# Altium project ESP32_INDUSTRIAL_IO_EXPANSION.PrjPcb
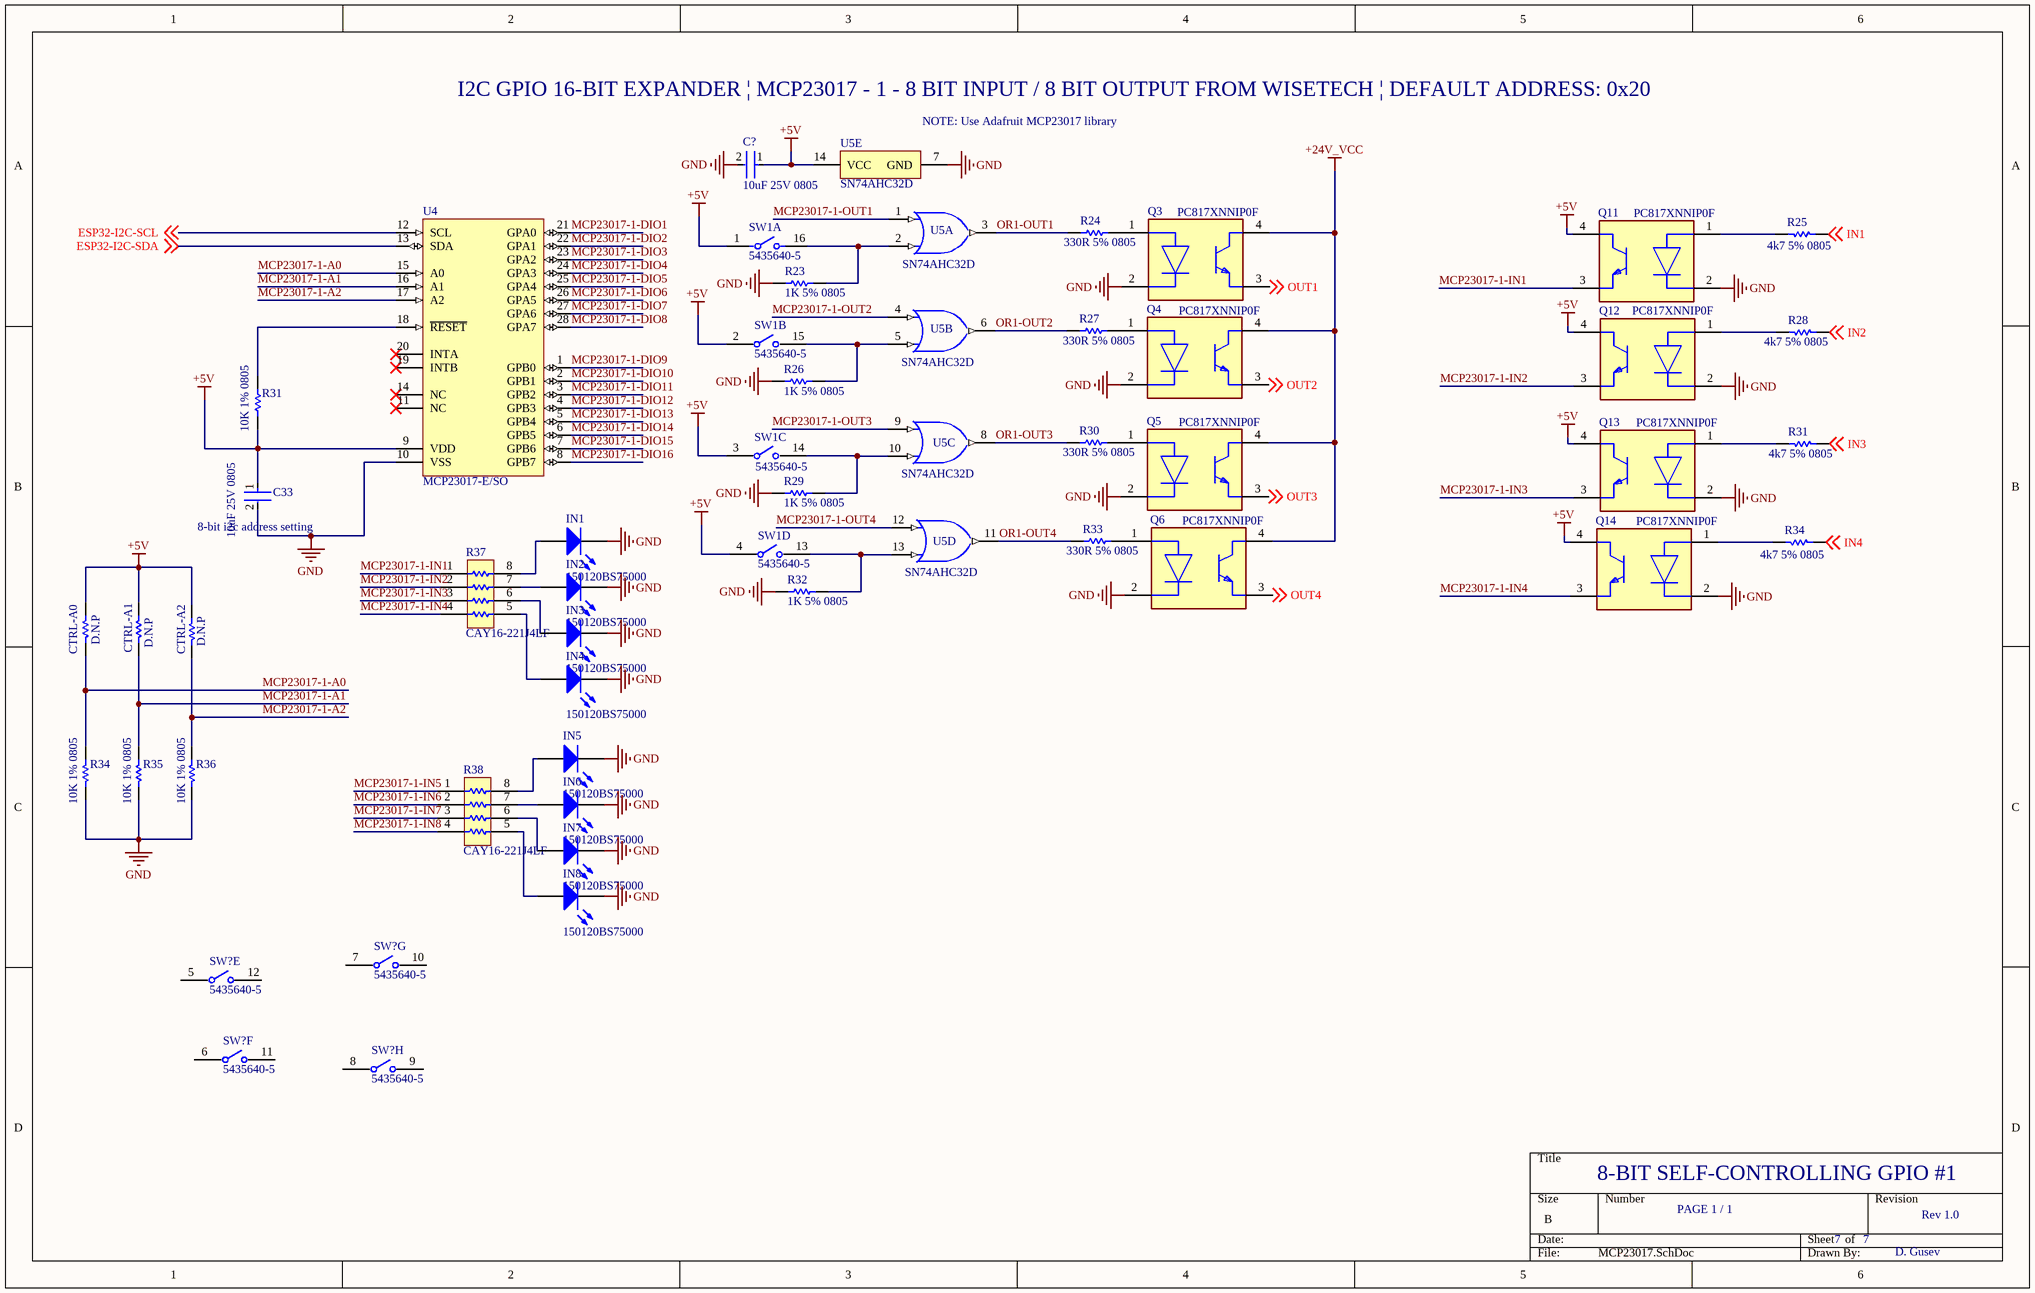
[diagram p0: MCP23017.SchDoc]
2 sheets, 63 parts. Net scope: global (net labels, ports and power ports of the same name join across sheets).
Sheets:
  MCP23017.SchDoc
  CONN.SchDoc

## Sheet MCP23017.SchDoc
size B

### Parts
(Parts that share a designator on the sheet are numbered #1, #2 ... from top to bottom, then left to right.)
C33  10uF 25V 0805  [FP-GRM21B-0_15-IPC_B]
C?  10uF 25V 0805  [FP-GRM21B-0_15-IPC_B]
CTRL-A0  D.N.P  [RESC2013X60X35LL10T20]
CTRL-A1  D.N.P  [RESC2013X60X35LL10T20]
CTRL-A2  D.N.P  [RESC2013X60X35LL10T20]
IN1  150120BS75000  [1206_A]
IN2  150120BS75000  [1206_A]
IN3  150120BS75000  [1206_A]
IN4  150120BS75000  [1206_A]
IN5  150120BS75000  [1206_A]
IN6  150120BS75000  [1206_A]
IN7  150120BS75000  [1206_A]
IN8  150120BS75000  [1206_A]
Q3  PC817XNNIP0F  [FP-PC817XNNIP0F-MFG]
Q4  PC817XNNIP0F  [FP-PC817XNNIP0F-MFG]
Q5  PC817XNNIP0F  [FP-PC817XNNIP0F-MFG]
Q6  PC817XNNIP0F  [FP-PC817XNNIP0F-MFG]
Q11  PC817XNNIP0F  [FP-PC817XNNIP0F-MFG]
Q12  PC817XNNIP0F  [FP-PC817XNNIP0F-MFG]
Q13  PC817XNNIP0F  [FP-PC817XNNIP0F-MFG]
Q14  PC817XNNIP0F  [FP-PC817XNNIP0F-MFG]
R23  1K 5% 0805  [RESC2013X60X35ML10T20]
R24  330R 5% 0805  [RESC2013X60X35LL10T20]
R25  4k7 5% 0805  [YAGO-RC0805_M]
R26  1K 5% 0805  [RESC2013X60X35ML10T20]
R27  330R 5% 0805  [RESC2013X60X35LL10T20]
R28  4k7 5% 0805  [YAGO-RC0805_M]
R29  1K 5% 0805  [RESC2013X60X35ML10T20]
R30  330R 5% 0805  [RESC2013X60X35LL10T20]
R31#1  10K 1% 0805  [RESC2013X60X35ML10T20]
R31#2  4k7 5% 0805  [YAGO-RC0805_M]
R32  1K 5% 0805  [RESC2013X60X35ML10T20]
R33  330R 5% 0805  [RESC2013X60X35LL10T20]
R34#1  4k7 5% 0805  [YAGO-RC0805_M]
R34#2  10K 1% 0805  [RESC2013X60X35ML10T20]
R35  10K 1% 0805  [RESC2013X60X35ML10T20]
R36  10K 1% 0805  [RESC2013X60X35ML10T20]
R37  CAY16-221J4LF  [BOUR-CAY16-J4_V]
R38  CAY16-221J4LF  [BOUR-CAY16-J4_V]
SW1  5435640-5  [FP-5435640-5-MFG]  (parts A,B,C,D of 8)
SW?#1  5435640-5  [FP-5435640-5-MFG]  (part G of 8)
SW?#2  5435640-5  [FP-5435640-5-MFG]  (part E of 8)
SW?#3  5435640-5  [FP-5435640-5-MFG]  (part F of 8)
SW?#4  5435640-5  [FP-5435640-5-MFG]  (part H of 8)
U4  MCP23017-E/SO  [SOIC-SO28_N]
U5  SN74AHC32D  [D0014A_M]  (parts A,B,C,D,E of 5)

### Nets
+5V: C33.1 C?.1 CTRL-A0.2 CTRL-A1.2 CTRL-A2.2 Q11.4(C) Q12.4(C) Q13.4(C) Q14.4(C) R31#1.1 SW1.1 SW1.2 SW1.3 SW1.4 U4.9(VDD) U5.14(VCC)
+24V_VCC: Q3.4(C) Q4.4(C) Q5.4(C) Q6.4(C)
GND: C33.2 C?.2 IN1.1(K) IN2.1(K) IN3.1(K) IN4.1(K) IN5.1(K) IN6.1(K) IN7.1(K) IN8.1(K) Q3.2(C) Q4.2(C) Q5.2(C) Q6.2(C) Q11.2(C) Q12.2(C) Q13.2(C) Q14.2(C) R23.1 R26.1 R29.1 R32.1 R34#2.2 R35.2 R36.2 U4.10(VSS) U5.7(GND)
ESP32-I2C-SCL: U4.12(SCL) ; off-sheet ESP32-I2C-SCL
ESP32-I2C-SDA: U4.13(SDA) ; off-sheet ESP32-I2C-SDA
IN1: R25.1 ; off-sheet IN1
IN2: R28.1 ; off-sheet IN2
IN3: R31#2.1 ; off-sheet IN3
IN4: R34#1.1 ; off-sheet IN4
MCP23017-1-A0: CTRL-A0.1 R34#2.1 U4.15(A0)
MCP23017-1-A1: CTRL-A1.1 R35.1 U4.16(A1)
MCP23017-1-A2: CTRL-A2.1 R36.1 U4.17(A2)
MCP23017-1-DIO1: U4.21(GPA0)
MCP23017-1-DIO2: U4.22(GPA1)
MCP23017-1-DIO3: U4.23(GPA2)
MCP23017-1-DIO4: U4.24(GPA3)
MCP23017-1-DIO5: U4.25(GPA4)
MCP23017-1-DIO6: U4.26(GPA5)
MCP23017-1-DIO7: U4.27(GPA6)
MCP23017-1-DIO8: U4.28(GPA7)
MCP23017-1-DIO9: U4.1(GPB0)
MCP23017-1-DIO10: U4.2(GPB1)
MCP23017-1-DIO11: U4.3(GPB2)
MCP23017-1-DIO12: U4.4(GPB3)
MCP23017-1-DIO13: U4.5(GPB4)
MCP23017-1-DIO14: U4.6(GPB5)
MCP23017-1-DIO15: U4.7(GPB6)
MCP23017-1-DIO16: U4.8(GPB7)
MCP23017-1-IN1: Q11.3(E) R37.1
MCP23017-1-IN2: Q12.3(E) R37.2
MCP23017-1-IN3: Q13.3(E) R37.3
MCP23017-1-IN4: Q14.3(E) R37.4
MCP23017-1-IN5: R38.1
MCP23017-1-IN6: R38.2
MCP23017-1-IN7: R38.3
MCP23017-1-IN8: R38.4
MCP23017-1-OUT1: U5.1(1A)
MCP23017-1-OUT2: U5.4(2A)
MCP23017-1-OUT3: U5.9(3A)
MCP23017-1-OUT4: U5.12(4A)
OR1-OUT1: R24.1 U5.3(1Y)
OR1-OUT2: R27.1 U5.6(2Y)
OR1-OUT3: R30.1 U5.8(3Y)
OR1-OUT4: R33.1 U5.11(4Y)
OUT1: Q3.3(E) ; off-sheet OUT1
OUT2: Q4.3(E) ; off-sheet OUT2
OUT3: Q5.3(E) ; off-sheet OUT3
OUT4: Q6.3(E) ; off-sheet OUT4
NetIN1_2: IN1.2(A) R37.8
NetIN2_2: IN2.2(A) R37.7
NetIN3_2: IN3.2(A) R37.6
NetIN4_2: IN4.2(A) R37.5
NetIN5_2: IN5.2(A) R38.8
NetIN6_2: IN6.2(A) R38.7
NetIN7_2: IN7.2(A) R38.6
NetIN8_2: IN8.2(A) R38.5
NetQ3_1: Q3.1(A) R24.2
NetQ4_1: Q4.1(A) R27.2
NetQ5_1: Q5.1(A) R30.2
NetQ6_1: Q6.1(A) R33.2
NetQ11_1: Q11.1(A) R25.2
NetQ12_1: Q12.1(A) R28.2
NetQ13_1: Q13.1(A) R31#2.2
NetQ14_1: Q14.1(A) R34#1.2
NetR23_2: R23.2 SW1.16 U5.2(1B)
NetR26_2: R26.2 SW1.15 U5.5(2B)
NetR29_2: R29.2 SW1.14 U5.10(3B)
NetR31#1_2: R31#1.2 U4.18(~{RESET})
NetR32_2: R32.2 SW1.13 U5.13(4B)

Not connected (* = marked no-connect by the designer): SW?#1 7 10; SW?#2 5 12; SW?#3 6 11; SW?#4 8 9; U4 11(NC)* 14(NC)* 19(INTB)* 20(INTA)*

### Notes on the sheet
- I2C GPIO 16-BIT EXPANDER | MCP23017 - 1 - 8 BIT INPUT / 8 BIT OUTPUT FROM WISETECH | DEFAULT ADDRESS: 0x20
- (near U5) NOTE: Use Adafruit MCP23017 library
- 8-bit i2c address setting
- 8-BIT SELF-CONTROLLING GPIO #1
- PAGE 1 / 1
- 7
- Rev 1.0
- D. Gusev

### Library data of the parts
C33 C? = CMP-2007-03541-2: Chip Multilayer Ceramic Capacitors for General Purpose, 0805, 10uF, X5R, 15%, 10%, 25V; Length: 2mm; Depth: 1.25mm; Termination: SMD/SMT; Voltage: 25V; Height: 1.25mm; Material: Ceramic; Thickness: 0.053inch; Radiation Hardening: No; Min Operating Temperature: -55°C; Width: 0.049inch; Package Quantity: 1; Mount: Surface Mount; Dielectric: X5R; Packaging: Tape and Reel; Capacitance: 10uF; Voltage Rating (DC): 25V; Lead Free: Lead Free; Max Operating Temperature: 85°C; Case Code (Imperial): 0805; Case/Package: 0805; Tolerance: 10%; Voltage Rating: 25V; Case Code (Metric): 2012
CTRL-A0-CTRL-A2 = CMP-1659-00014-4: Chip Resistor, 1 Ohm, +/- 1%, 125 mW, -55 to 155 degC, 0805 (2012 Metric), RoHS, Tape and Reel; Manufacturer: Yageo; Voltage Rating: 150 V; REACH SVHC: No SVHC; Mounting Technology: Surface Mount; RoHSCompliant: true; Packaging: Tape and Reel; ComponentLink2URL: http://www.yageo.com/documents/recent/PYu-RC_Group_51_RoHS_L_04.pdf; Pins: 2; Package Quantity: 5000; DatasheetVersion: Rev. 4, 02/2016; Mount: Surface Mount; Max Operating Temperature: 155 degC; PackageDescription: 2-Pin Surface Mounted Device, Body 2 x 1.25 mm; PackageReference: 0805; Length: 2 mm; Min Operating Temperature: -55 degC; ComponentLink1URL: http://www.yageo.com/; Height: 0.5 mm; ComponentLink1Description: Manufacturer URL; ComponentLink2Description: Datasheet
IN1-IN8 = CMP-1426-00015-1: SMD mono-color Chip LED, WL-SMCW, Blue; Manufacturer: Wuerth Elektronik; ComponentLink2Description: Datasheet; ComponentLink1URL: http://www.we-online.com; PartNumber: 150120BS75000; ComponentLink1Description: Manufacturer URL; ComponentLink2URL: http://katalog.we-online.com/led/datasheet/150120BS75000.pdf; PackageReference: 1206_A; Color: Blue
Q3-Q6 Q11-Q14 = CMP-65434-000005-1: OPTOISOLATOR 5KV TRANS 4SMD; Reverse Breakdown Voltage: 6V; Output Current per Channel: 30mA; Power Dissipation: 200mW; Collector-emitter Voltage-Max: 200mV; Max Output Voltage: 80V; Input Current: 50mA; Forward Voltage: 1.4V; Fall Time: 18000ns; Number of Elements: 1; Input Type: DC; Packaging: Tape and Reel; RoHS Compliant: Yes; Contact Plating: Copper; Min Operating Temperature: -30°C; Collector Emitter Saturation Voltage: 200mV; Max Input Current: 50mA; Radiation Hardening: No; Max Collector Current: 50mA; Case/Package: SMD/SMT; Mount: Surface Mount; Output Voltage: 80V; Forward Current: 50mA; Max Power Dissipation: 200mW; Collector Emitter Voltage (VCEO): 80V; Number of Channels: 1; Rise Time: 18000ns; Isolation Voltage: 5kV; Number of Pins: 4; Lead Free: Lead Free; Package Quantity: 2000; Isolation Voltage-Max: 5kV; Max Operating Temperature: 100°C
R23 R26 R29 R32 = CMP-2100-03671-1: Chip Resistor, 1 KOhm, +/- 1%, 125 mW, -55 to 155 degC, 0805 (2012 Metric), RoHS, Tape and Reel; Manufacturer: Yageo; Temperature Coefficient: 100ppm/degreesC; Voltage Rating (DC): 150V; Max Power Dissipation: 125mW; Resistance: 1KOhm; Number of Pins: 2; Number of Terminations: 2; Datasheet URL: http://www.yageo.com/NewPortal/yageodocoutput?fileName=/pdf/R-Chip/PYu-RC_Group_51_RoHS_L_5.pdf; Length: 0.079inch; Package Description: 2-Pin Surface Mounted Device, Body 2 x 1.25 mm; Depth: 1.25mm; Height: 0.024inch; Military Standard: Not; Case/Package: 0805; Package Reference: 0805; RoHSCompliant: true; Lead Free: LeadFree; Packaging: TapeandReel; Package Quantity: 1; Datasheet Version: Rev. 5, 10/2016; Tolerance: 1%; Min Operating Temperature: -55degC; Voltage Rating: 150V; Composition: ThickFilm; Case Code (Imperial): 0805; Power Rating: 125mW; Width: 0.049inch; Case Code (Metric): 2012; Manufacturer URL: http://www.yageo.com/; Max Operating Temperature: 155degC; REACH SVHC: Unknown; Termination: SMD/SMT
R24 R27 R30 R33 = CMP-2000-06960-1: Chip Resistor, 330 Ohm, +/- 1%, 125 mW, -55 to 155 degC, 0805 (2012 Metric), RoHS, Tape and Reel; Manufacturer: Yageo; Voltage Rating: 150V; Temperature Coefficient: 100PPM/C; Power Rating: 125mW(1/8W); Resistance: 330Ohms; Datasheet Version: Rev. 7, 05/2017; Termination Style: SMD/SMT; Case Code - mm: 2012; Package Description: 2-Pin Surface Mounted Device, Body 2 x 1.25 mm; Operating Temperature Range: -55Cto+155C; Case Code - in: 0805; Packaging: Reel; Tolerance: 1%; Package Reference: 0805; Mounting Technology: SurfaceMount; Product: ThickFilmResistorsGeneralPurpose; Series: RC; Manufacturer URL: http://www.yageo.com/; Datasheet URL: http://www.yageo.com/documents/recent/PYu-RC_Group_51_RoHS_L_7.pdf
R25 R28 R31#2 R34#1 = CMP-1568-00001-1: General Puprose Chip Resistor, 4700 Ohm +/- 1%, 0.125 W, -55 to 155 degC, 2-Pin SMD, RoHS, Tape and Reel; PartNumber: RC0805FR-074K7L; Tolerance: +/- 1%; Power: 0.125 W; PackageDescription: 2-Pin Surface Mount Device, Body 2 x 1.25 mm; ComponentLink2URL: http://www.yageo.com/documents/recent/PYu-RC_Group_51_RoHS_L-3.pdf; Temperature Min: -55 degC; Packing: Tape and Reel; Mounting Technology: Surface Mount; ComponentLink1URL: http://www.yageo.com/NewPortal/_en/index.jsp; Resistance: 4700 Ohm; Temperature Max: 155 degC; ComponentLink2Description: Datasheet; DatasheetVersion: Rev. 3; RoHS: TRUE; ComponentLink1Description: Manufacturer URL
R31#1 R34#2 R35 R36 = CMP-2000-05025-1: Chip Resistor, 10 KOhm, +/- 5%, 0.125 W, -55 to 155 degC, 0805 (2012 Metric), RoHS, Tape and Reel; Manufacturer: Yageo; Resistor Element Type: ThickFilm; Voltage Rating: 150V; Product Range: RCSeries; SVHC: ToBeAdvised; Resistor Case Style: 0805[2012Metric]; Temperature Coefficient: ±100ppm/degC; Power Rating: 250mW; Resistance: 10kohm; Automotive Qualification Standard: -; Datasheet Version: REV. 2, 09/2004; Packaging: CutTape; Resistance Tolerance: ±5%; MSL: MSL1-Unlimited; Manufacturer URL: http://www.yageo.com/; Datasheet URL: http://www.yageo.ru/pdf/RC0805.pdf; Package Description: 2-Pin Surface Mounted Device, Body 2 x 1.25 mm; Package Reference: 805
R37 R38 = CMP-1747-00006-1: Chip Resistor Array, 220 Ohm, +/- 5%, 62.5 mW, -55 to 125 degC, 8-Pin SMD, RoHS, Tape and Reel; Resistance: 562 kohm; Tolerance: 1%; Case\Package: 0603; Power Rating: 100 mW; Voltage Rating: 50 V; Max Operating Temperature: 155 degC; ComponentLink2Description: Datasheet; ComponentLink1Description: Manufacturer URL; Height: 0.45 mm; Min Operating Temperature: -55 degC; Length: 1.6 mm; DatasheetVersion: Sep-14; ComponentLink1URL: http://www.bourns.com/; ComponentLink2URL: http://www.bourns.com/pdfs/CATCAY.pdf; Case Code (Imperial): 0603; PackageReference: CAY16-J4; Packaging: Tape and Reel; Case Code (Metric): 1608; RoHSCompliant: true; PackageDescription: 8-Pin Surface Mount Device, Body 1.6 x 3.2 mm, Pitch 0.8 mm
SW1 SW?#1-SW?#4 = CMP-05209-000001-1: SWITCH ROCKER DIP SPST 60MA 5V; Contact Post Length: 0.14inch; Number of Switches: 8; Contact Resistance: 50mR; Actuator Material: Polyester; Pitch: 0.1inch; Sealable: No (Without); Actuator Length: 1.27mm; Contact Current Rating: 1A; Max Voltage Rating (DC): 24V; Washable: No; Voltage Rating (DC): 40V; Contact Plating: Gold; ELV: Compliant; Depth: 9.65mm; Height: 0.34inch; Length: 0.88inch; Housing Material: Polyester; Contact Material: Copper Alloy; Orientation: Straight; Series: 7100; Throw Configuration: SPST; RoHS Compliant: Yes; Case/Package: DIP; Radiation Hardening: No; Max Operating Temperature: 105°C; Lead Free: Lead Free; Current Rating: 60mA; Housing Color: Blue; Min Operating Temperature: -55°C; Actuator Type: Rocker; Package Quantity: 14; Number of Circuits: 8; Mount: Through Hole; Type: Switch; Terminal Pitch: 2.54mm; Termination: PC Pins; Packaging: Rail/Tube; Number of Positions: 8
U4 = CMP-0186-00161-2: 16-Bit I/O Expander with Serial Interface, 28-Pin SOIC, Extended Temperature; PackageReference: SOIC-SO28; ComponentLink2URL: http://ww1.microchip.com/downloads/en/DeviceDoc/21952b.pdf; PackageVersion: revBB, Aug-2009; ComponentLink1URL: http://www.microchip.com/; Code_JEDEC: MS-013; ComponentLink2Description: Datasheet; DatasheetVersion: revB, Feb-2007; PackageDescription: 28-Lead Plastic Small Outline (SO) - Wide 7.50mm Body [SOIC]; ComponentLink3Description: Package Specification; ComponentLink1Description: Manufacturer URL; RevisionNote: URLs added.; ComponentLink3URL: http://www.microchip.com/stellent/groups/techpub_sg/documents/packagingspec/en012702.pdf
U5 = CMP-1573-00034-3: Quadruple 2-Input Positive-OR Gates, D0014A, TUBE; Manufacturer: Texas Instruments; Input Type: CMOS; VCC(Max)(V): 5.5; tpd @ Nom Voltage(Max)(ns): 13,8.5; F @ Nom Voltage(Max)(Mhz): 70; VCC(Min)(V): 2; Bits(#): 4; ICC @ Nom Voltage(Max)(mA): 0.02; Rating: Catalog; Output Drive (IOL/IOH)(Max)(mA): 50/-50; Voltage(Nom)(V): 3.3,5; Operating Temperature Range(C): -40 to 125; DatasheetVersion: SCLS247I; Output Type: CMOS; PackageVersion: http://www.ti.com/lit/ml/mpds177g/mpds177g.pdf; Code_JEDEC: MS-012; Generic Part Number: SN74AHC32; PackageReference: D0014A

## Sheet CONN.SchDoc
size B
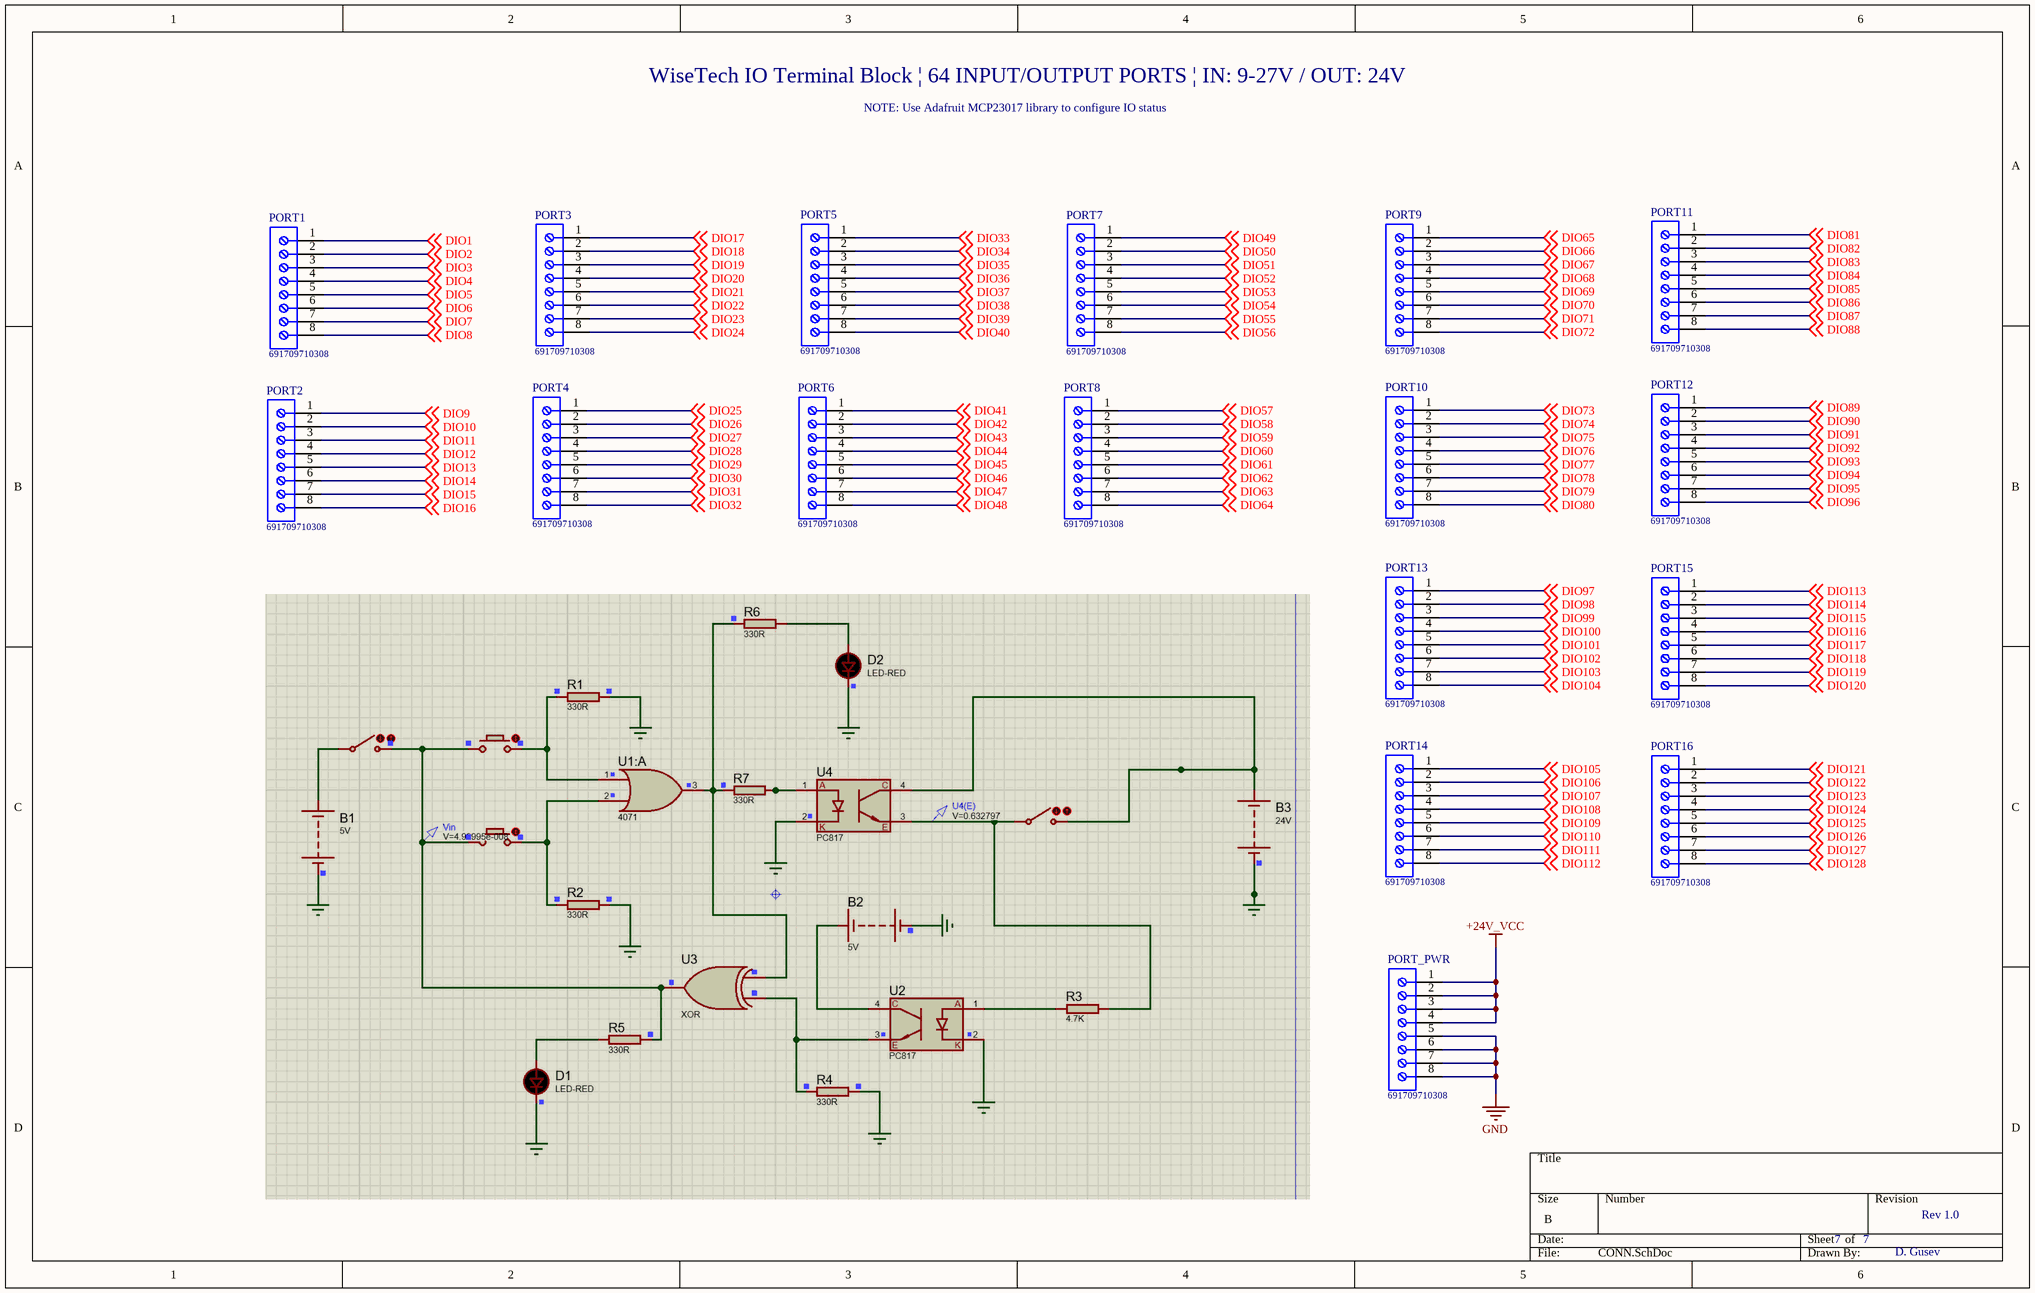
[diagram p1: CONN.SchDoc]

### Parts
PORT1  691709710308  [691709710308]
PORT2  691709710308  [691709710308]
PORT3  691709710308  [691709710308]
PORT4  691709710308  [691709710308]
PORT5  691709710308  [691709710308]
PORT6  691709710308  [691709710308]
PORT7  691709710308  [691709710308]
PORT8  691709710308  [691709710308]
PORT9  691709710308  [691709710308]
PORT10  691709710308  [691709710308]
PORT11  691709710308  [691709710308]
PORT12  691709710308  [691709710308]
PORT13  691709710308  [691709710308]
PORT14  691709710308  [691709710308]
PORT15  691709710308  [691709710308]
PORT16  691709710308  [691709710308]
PORT_PWR  691709710308  [691709710308]

### Nets
+24V_VCC: PORT_PWR.1 PORT_PWR.2 PORT_PWR.3 PORT_PWR.4
GND: PORT_PWR.5 PORT_PWR.6 PORT_PWR.7 PORT_PWR.8
DIO1: PORT1.1 ; off-sheet DIO1
DIO2: PORT1.2 ; off-sheet DIO2
DIO3: PORT1.3 ; off-sheet DIO3
DIO4: PORT1.4 ; off-sheet DIO4
DIO5: PORT1.5 ; off-sheet DIO5
DIO6: PORT1.6 ; off-sheet DIO6
DIO7: PORT1.7 ; off-sheet DIO7
DIO8: PORT1.8 ; off-sheet DIO8
DIO9: PORT2.1 ; off-sheet DIO9
DIO10: PORT2.2 ; off-sheet DIO10
DIO11: PORT2.3 ; off-sheet DIO11
DIO12: PORT2.4 ; off-sheet DIO12
DIO13: PORT2.5 ; off-sheet DIO13
DIO14: PORT2.6 ; off-sheet DIO14
DIO15: PORT2.7 ; off-sheet DIO15
DIO16: PORT2.8 ; off-sheet DIO16
DIO17: PORT3.1 ; off-sheet DIO17
DIO18: PORT3.2 ; off-sheet DIO18
DIO19: PORT3.3 ; off-sheet DIO19
DIO20: PORT3.4 ; off-sheet DIO20
DIO21: PORT3.5 ; off-sheet DIO21
DIO22: PORT3.6 ; off-sheet DIO22
DIO23: PORT3.7 ; off-sheet DIO23
DIO24: PORT3.8 ; off-sheet DIO24
DIO25: PORT4.1 ; off-sheet DIO25
DIO26: PORT4.2 ; off-sheet DIO26
DIO27: PORT4.3 ; off-sheet DIO27
DIO28: PORT4.4 ; off-sheet DIO28
DIO29: PORT4.5 ; off-sheet DIO29
DIO30: PORT4.6 ; off-sheet DIO30
DIO31: PORT4.7 ; off-sheet DIO31
DIO32: PORT4.8 ; off-sheet DIO32
DIO33: PORT5.1 ; off-sheet DIO33
DIO34: PORT5.2 ; off-sheet DIO34
DIO35: PORT5.3 ; off-sheet DIO35
DIO36: PORT5.4 ; off-sheet DIO36
DIO37: PORT5.5 ; off-sheet DIO37
DIO38: PORT5.6 ; off-sheet DIO38
DIO39: PORT5.7 ; off-sheet DIO39
DIO40: PORT5.8 ; off-sheet DIO40
DIO41: PORT6.1 ; off-sheet DIO41
DIO42: PORT6.2 ; off-sheet DIO42
DIO43: PORT6.3 ; off-sheet DIO43
DIO44: PORT6.4 ; off-sheet DIO44
DIO45: PORT6.5 ; off-sheet DIO45
DIO46: PORT6.6 ; off-sheet DIO46
DIO47: PORT6.7 ; off-sheet DIO47
DIO48: PORT6.8 ; off-sheet DIO48
DIO49: PORT7.1 ; off-sheet DIO49
DIO50: PORT7.2 ; off-sheet DIO50
DIO51: PORT7.3 ; off-sheet DIO51
DIO52: PORT7.4 ; off-sheet DIO52
DIO53: PORT7.5 ; off-sheet DIO53
DIO54: PORT7.6 ; off-sheet DIO54
DIO55: PORT7.7 ; off-sheet DIO55
DIO56: PORT7.8 ; off-sheet DIO56
DIO57: PORT8.1 ; off-sheet DIO57
DIO58: PORT8.2 ; off-sheet DIO58
DIO59: PORT8.3 ; off-sheet DIO59
DIO60: PORT8.4 ; off-sheet DIO60
DIO61: PORT8.5 ; off-sheet DIO61
DIO62: PORT8.6 ; off-sheet DIO62
DIO63: PORT8.7 ; off-sheet DIO63
DIO64: PORT8.8 ; off-sheet DIO64
DIO65: PORT9.1 ; off-sheet DIO65
DIO66: PORT9.2 ; off-sheet DIO66
DIO67: PORT9.3 ; off-sheet DIO67
DIO68: PORT9.4 ; off-sheet DIO68
DIO69: PORT9.5 ; off-sheet DIO69
DIO70: PORT9.6 ; off-sheet DIO70
DIO71: PORT9.7 ; off-sheet DIO71
DIO72: PORT9.8 ; off-sheet DIO72
DIO73: PORT10.1 ; off-sheet DIO73
DIO74: PORT10.2 ; off-sheet DIO74
DIO75: PORT10.3 ; off-sheet DIO75
DIO76: PORT10.4 ; off-sheet DIO76
DIO77: PORT10.5 ; off-sheet DIO77
DIO78: PORT10.6 ; off-sheet DIO78
DIO79: PORT10.7 ; off-sheet DIO79
DIO80: PORT10.8 ; off-sheet DIO80
DIO81: PORT11.1 ; off-sheet DIO81
DIO82: PORT11.2 ; off-sheet DIO82
DIO83: PORT11.3 ; off-sheet DIO83
DIO84: PORT11.4 ; off-sheet DIO84
DIO85: PORT11.5 ; off-sheet DIO85
DIO86: PORT11.6 ; off-sheet DIO86
DIO87: PORT11.7 ; off-sheet DIO87
DIO88: PORT11.8 ; off-sheet DIO88
DIO89: PORT12.1 ; off-sheet DIO89
DIO90: PORT12.2 ; off-sheet DIO90
DIO91: PORT12.3 ; off-sheet DIO91
DIO92: PORT12.4 ; off-sheet DIO92
DIO93: PORT12.5 ; off-sheet DIO93
DIO94: PORT12.6 ; off-sheet DIO94
DIO95: PORT12.7 ; off-sheet DIO95
DIO96: PORT12.8 ; off-sheet DIO96
DIO97: PORT13.1 ; off-sheet DIO97
DIO98: PORT13.2 ; off-sheet DIO98
DIO99: PORT13.3 ; off-sheet DIO99
DIO100: PORT13.4 ; off-sheet DIO100
DIO101: PORT13.5 ; off-sheet DIO101
DIO102: PORT13.6 ; off-sheet DIO102
DIO103: PORT13.7 ; off-sheet DIO103
DIO104: PORT13.8 ; off-sheet DIO104
DIO105: PORT14.1 ; off-sheet DIO105
DIO106: PORT14.2 ; off-sheet DIO106
DIO107: PORT14.3 ; off-sheet DIO107
DIO108: PORT14.4 ; off-sheet DIO108
DIO109: PORT14.5 ; off-sheet DIO109
DIO110: PORT14.6 ; off-sheet DIO110
DIO111: PORT14.7 ; off-sheet DIO111
DIO112: PORT14.8 ; off-sheet DIO112
DIO113: PORT15.1 ; off-sheet DIO113
DIO114: PORT15.2 ; off-sheet DIO114
DIO115: PORT15.3 ; off-sheet DIO115
DIO116: PORT15.4 ; off-sheet DIO116
DIO117: PORT15.5 ; off-sheet DIO117
DIO118: PORT15.6 ; off-sheet DIO118
DIO119: PORT15.7 ; off-sheet DIO119
DIO120: PORT15.8 ; off-sheet DIO120
DIO121: PORT16.1 ; off-sheet DIO121
DIO122: PORT16.2 ; off-sheet DIO122
DIO123: PORT16.3 ; off-sheet DIO123
DIO124: PORT16.4 ; off-sheet DIO124
DIO125: PORT16.5 ; off-sheet DIO125
DIO126: PORT16.6 ; off-sheet DIO126
DIO127: PORT16.7 ; off-sheet DIO127
DIO128: PORT16.8 ; off-sheet DIO128

### Notes on the sheet
- WiseTech IO Terminal Block | 64 INPUT/OUTPUT PORTS | IN: 9-27V / OUT: 24V
- NOTE: Use Adafruit MCP23017 library to configure IO status
- 7
- Rev 1.0
- D. Gusev

### Library data of the parts
PORT1-PORT16 PORT_PWR = CMP-1502-03340-1: Serie 7097 - 5.00 mm Horizontal Entry SMT with Pressure Clamp WR-TBL, 8 pin; Manufacturer: Wurth Elektronik; Pin Number: 8; Pitch: 5.00mm; Datasheet URL: http://katalog.we-online.de/em/datasheet/6917097103xx.pdf; Publisher: WurthElektronik; Part Number: 691709710308; Operating Temperature: -45to130degC; Mounting Technology: SMT; Package Reference: 691709710308; Packaging: TapeandReelwithCap; Manufacturer URL: http://www.we-online.de

## Nets that join several sheets
+24V_VCC: MCP23017 (Q3.4 Q4.4 Q5.4 Q6.4), CONN (PORT_PWR.1 PORT_PWR.2 PORT_PWR.3 PORT_PWR.4)
GND: MCP23017 (27 pins), CONN (PORT_PWR.5 PORT_PWR.6 PORT_PWR.7 PORT_PWR.8)